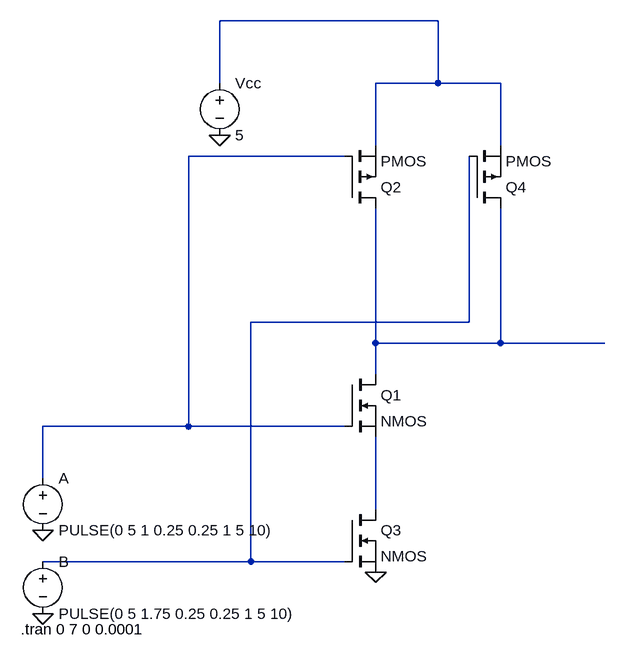
[diagram p0: schematic LTSPICE_NAND_GATE.asc]
LTSPICE_NAND_GATE.asc, the LTspice schematic file:
Version 4
SHEET 1 880 680
WIRE 432 -448 96 -448
WIRE 96 -352 96 -448
WIRE 432 -352 432 -448
WIRE 432 -352 336 -352
WIRE 528 -352 432 -352
WIRE 336 -256 336 -352
WIRE 528 -256 528 -352
WIRE 288 -240 48 -240
WIRE 480 16 480 -240
WIRE 480 16 144 16
WIRE 336 48 336 -160
WIRE 528 48 528 -160
WIRE 528 48 336 48
WIRE 688 48 528 48
WIRE 336 96 336 48
WIRE 48 176 48 -240
WIRE 48 176 -176 176
WIRE 288 176 48 176
WIRE -176 256 -176 176
WIRE 336 304 336 192
WIRE 144 384 144 16
WIRE 144 384 -176 384
WIRE 288 384 144 384
FLAG -176 336 0
FLAG -176 464 0
FLAG 96 -272 0
FLAG 336 400 0
SYMBOL voltage -176 368 R0
WINDOW 123 0 0 Left 2
WINDOW 39 0 0 Left 2
SYMATTR InstName B
SYMATTR Value PULSE(0 5 1.75 0.25 0.25 1 5 10)
SYMBOL voltage -176 240 R0
WINDOW 123 0 0 Left 2
WINDOW 39 0 0 Left 2
SYMATTR InstName A
SYMATTR Value PULSE(0 5 1 0.25 0.25 1 5 10)
SYMBOL voltage 96 -368 R0
SYMATTR InstName Vcc
SYMATTR Value 5
SYMBOL pmos 288 -160 M180
SYMATTR InstName Q2
SYMBOL pmos 480 -160 M180
SYMATTR InstName Q4
SYMBOL nmos 288 96 R0
SYMATTR InstName Q1
SYMBOL nmos 288 304 R0
SYMATTR InstName Q3
TEXT -210 488 Left 2 !.tran 0 7 0 0.0001

The netlist it stands for:
* LTSPICE_NAND_GATE.asc
V§B N003 0 PULSE(0 5 1.75 0.25 0.25 1 5 10)
V§A N002 0 PULSE(0 5 1 0.25 0.25 1 5 10)
Vcc N001 0 5
M§Q2 N004 N002 N001 N001 PMOS
M§Q4 N004 N003 N001 N001 PMOS
M§Q1 N004 N002 N005 N005 NMOS
M§Q3 N005 N003 0 0 NMOS
.model NMOS NMOS
.model PMOS PMOS
.lib standard.mos
.tran 0 7 0 0.0001
.backanno
.end